# Altium schematic sheet Power_supply.SchDoc
size 420 x 297 mm; Address1: Address1; Address2: Address2; Address3: Address3; Address4: Address4; DocumentNumber: *Э3; SheetNumber: 4; SheetTotal: 14; DocumentType: Схема электрическая *
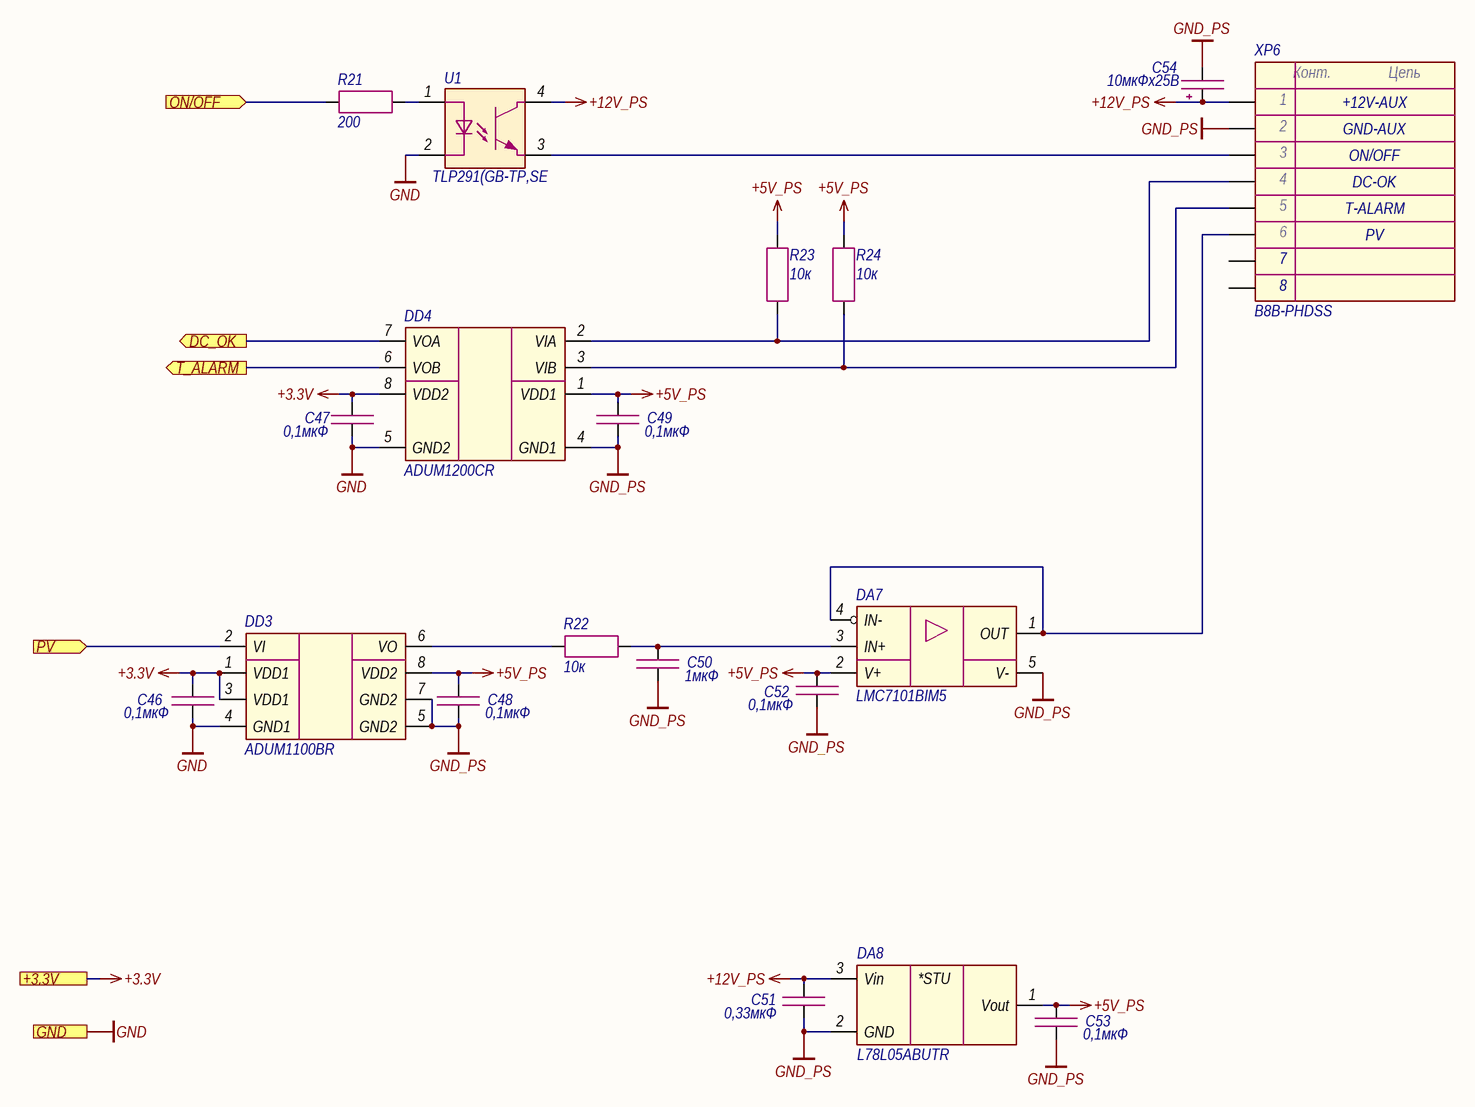
[diagram p0: Power_supply.SchDoc]

## Parts
C46  0,1мкФ  [CAP_0603]
C47  0,1мкФ  [CAP_0603]
C48  0,1мкФ  [CAP_0603]
C49  0,1мкФ  [CAP_0603]
C50  1мкФ  [CAP_0603]
C51  0,33мкФ  [CAP_0805]
C52  0,1мкФ  [CAP_0603]
C53  0,1мкФ  [CAP_0603]
C54  10мкФх25B  [CAP_B]
DA7  LMC7101BIM5  [SOT-23-5]
DA8  L78L05ABUTR  [SOT-89]
DD3  ADUM1100BR  [SOIC-8]
DD4  ADUM1200CR  [SOIC-8]
R21  200  [RES_0603]
R22  10к  [RES_0603]
R23  10к  [RES_0603]
R24  10к  [RES_0603]
U1  TLP291(GB-TP,SE  [11-3C1]
XP6  B8B-PHDSS  [B8B-PHDSS]

## Ports
+3.3V (see Main[1B], Button[1D], Ethernet[3D], Fiber_interlock[2C], Flow_sensor[2C], LD_driver[1D], RS-485[2C]), DC_OK (out, see Main[2B]), GND (see Main[1B], Button[1D], Column[1C], Ethernet[3D], Fiber_interlock[2C], Flow_sensor[2C], Guide_laser[1C], Indication[1C], LD_driver[1D], RS-485[2C]), ON/OFF (in, see Main[1B]), PV (in, see Main[1B]), T_ALARM (out, see Main[2B])

## Nets
+3.3V: C46.1 C47.1 DD3.1(VDD1) DD3.3(VDD1) DD4.8(VDD2) ; port +3.3V
+5V_PS: C48.1 C49.1 C52.1 C53.1 DA7.2(V+) DA8.1(Vout) DD3.8(VDD2) DD4.1(VDD1) R23.1 R24.1
+12V_PS: C51.2 C54.1 DA8.3(Vin) U1.4 XP6.1
GND: C46.2 C47.2 DD3.4(GND1) DD4.5(GND2) U1.2 ; port GND
GND_PS: C48.2 C49.2 C50.2 C51.1 C52.2 C53.2 C54.2 DA7.5(V-) DA8.2(GND) DD3.5(GND2) DD3.7(GND2) DD4.4(GND1) XP6.2
DC_OK: DD4.7(VOA) ; port DC_OK
ON/OFF: R21.1 ; port ON/OFF
PV: DD3.2(VI) ; port PV
T_ALARM: DD4.6(VOB) ; port T_ALARM
NetC50_1: C50.1 DA7.3(IN+) R22.2
NetDA7_1: DA7.1(OUT) DA7.4(IN-) XP6.6
NetDD3_6: DD3.6(VO) R22.1
NetDD4_2: DD4.2(VIA) R23.2 XP6.4
NetDD4_3: DD4.3(VIB) R24.2 XP6.5
NetR21_2: R21.2 U1.1
NetU1_3: U1.3 XP6.3

Not connected (* = marked no-connect by the designer): XP6 7 8

## Notes on the sheet
- +12V-AUX
- DC-OK
- ON/OFF
- GND-AUX
- T-ALARM
- PV
- Подп. и дата
- Инв. № дубл.
- Взам. инв. №
- Инв. № подл.
- Изм.
- Лист
- № докум.
- Подп.
- Дата
- Копировал
- Формат А3
- (in symbol Connector-8) Конт.; Цепь
- (in symbol LD2981ABU50TR) *STU

## Library data of the parts
C46-C49 C52 C53 = Capacitor: Manufacturer: Murata; Model: GRM188R71H104KA93D; Value: 0,1мкФ; Document: *
C50 = Capacitor: Manufacturer: Murata; Model: GRM188R61H105KAALD; Value: 1мкФ; Document: *
C51 = Capacitor: Manufacturer: Murata; Model: GRM219R71H334KA88D; Value: 0,33мкФ; Document: *
C54 = Capacitor_Polar: Model: TECAP, 10 мкФ, 25 В, тип B, 10%; Value: 10мкФх25B; Document: *; Manufacturer: *
DA7 = LMC7101: Manufacturer: Texas Instruments; Model: LMC7101BIM5; Document: *
DA8 = LD2981ABU50TR: Manufacturer: STMicroelectronics; Model: L78L05ABUTR; Document: *
DD3 = ADUM1100: Manufacturer: Analog Devices; Model: ADUM1100BR; Document: *
DD4 = ADUM1200: Manufacturer: Analog Devices; Model: ADUM1200CR; Document: *
R21 = Resistor: Manufacturer: Yageo; Model: RC0603FR-07200RL; Value: 200; Document: *
R22-R24 = Resistor: Manufacturer: Yageo; Model: RC0603FR-0710KL; Value: 10к; Document: *
U1 = TLP291: Manufacturer: Toshiba; Model: TLP291(GB-TP,SE; Document: *
XP6 = Connector-8: Manufacturer: JST; Model: B8B-PHDSS; Document: *